# Altium schematic sheet CVT Temperature.SchDoc
size A; SheetNumber: 6; SheetTotal: 10
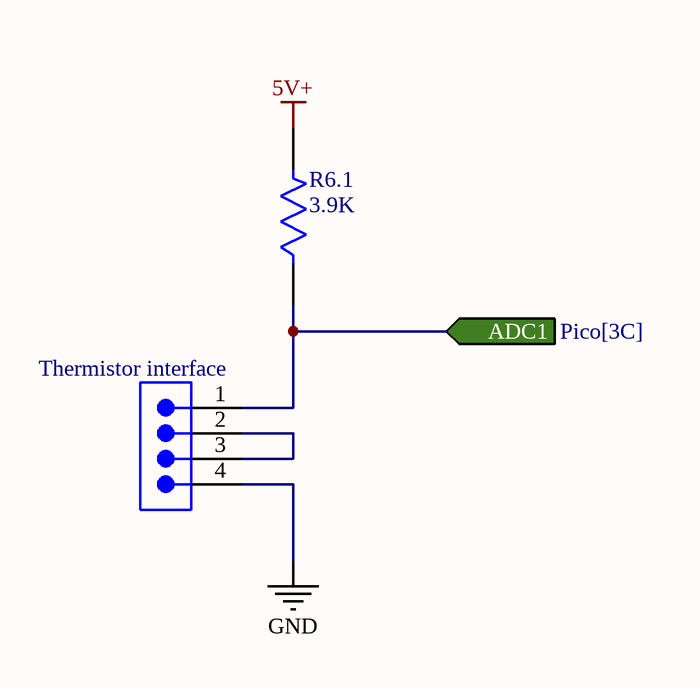
[diagram p0: CVT Temperature.SchDoc]

## Parts
R6.1  3.9K  [FP-MFR-12-MFG]
Thermistor_interface  4 Pin Header  [SMTC-TSW-104-08-X-S]  (value not drawn)

## Ports
ADC1 (in, see Pico[3C])

## Nets
5V+: R6.1.2
GND: Thermistor_interface.4
ADC1: R6.1.1 Thermistor_interface.1 ; port ADC1
NetThermistor_interface_2: Thermistor_interface.2 Thermistor_interface.3

## Library data of the parts
R6.1 = CMP-03413-000012-1: RES MF 1/6W 1% AXIAL; Power Rating: 160mW; Voltage Rating (DC): 200V; Resistance: 10kR; Min Operating Temperature: -55°C; Max Operating Temperature: 155°C; Voltage Rating: 200V; Termination: Axial; Packaging: Ammo Pack; Tolerance: 1%
Thermistor_interface = CMP-1024-00357-1: 0.025" SQ Post Header, Through-hole, Vertical, -55 to 125 degC, 2.54 mm Pitch, 4-Pin, Male, RoHS; Manufacturer: Samtec; PartNumber: TSW-104-08-G-S; Pitch: 2.54 mm; RoHS: True; ComponentLink3URL: http://www.samtec.com/documents/webfiles/cpdf/TSW-XXX-XX-XXX-X-XX-XXX-MKT.pdf; Mounting Technology: Through-hole; ComponentLink2URL: http://www.samtec.com/documents/webfiles/pdf/TSW_TH.PDF; ComponentLink1URL: http://www.samtec.com; ComponentLink3Description: Package Specification; PackageVersion: DM, 8/1988; ComponentLink2Description: Datasheet; PackageReference: TSW-104-08-X-S; PackageDescription: .025[0.64] SQ. Post Terminal Strip Assembly; ComponentLink1Description: Manufacturer URL; Temperature Range: -55 to 125 degC; DatasheetVersion: F-214; Orientation: Vertical